# Altium schematic sheet Inputs1.SchDoc
size A4; SheetNumber: 3; SheetTotal: 4
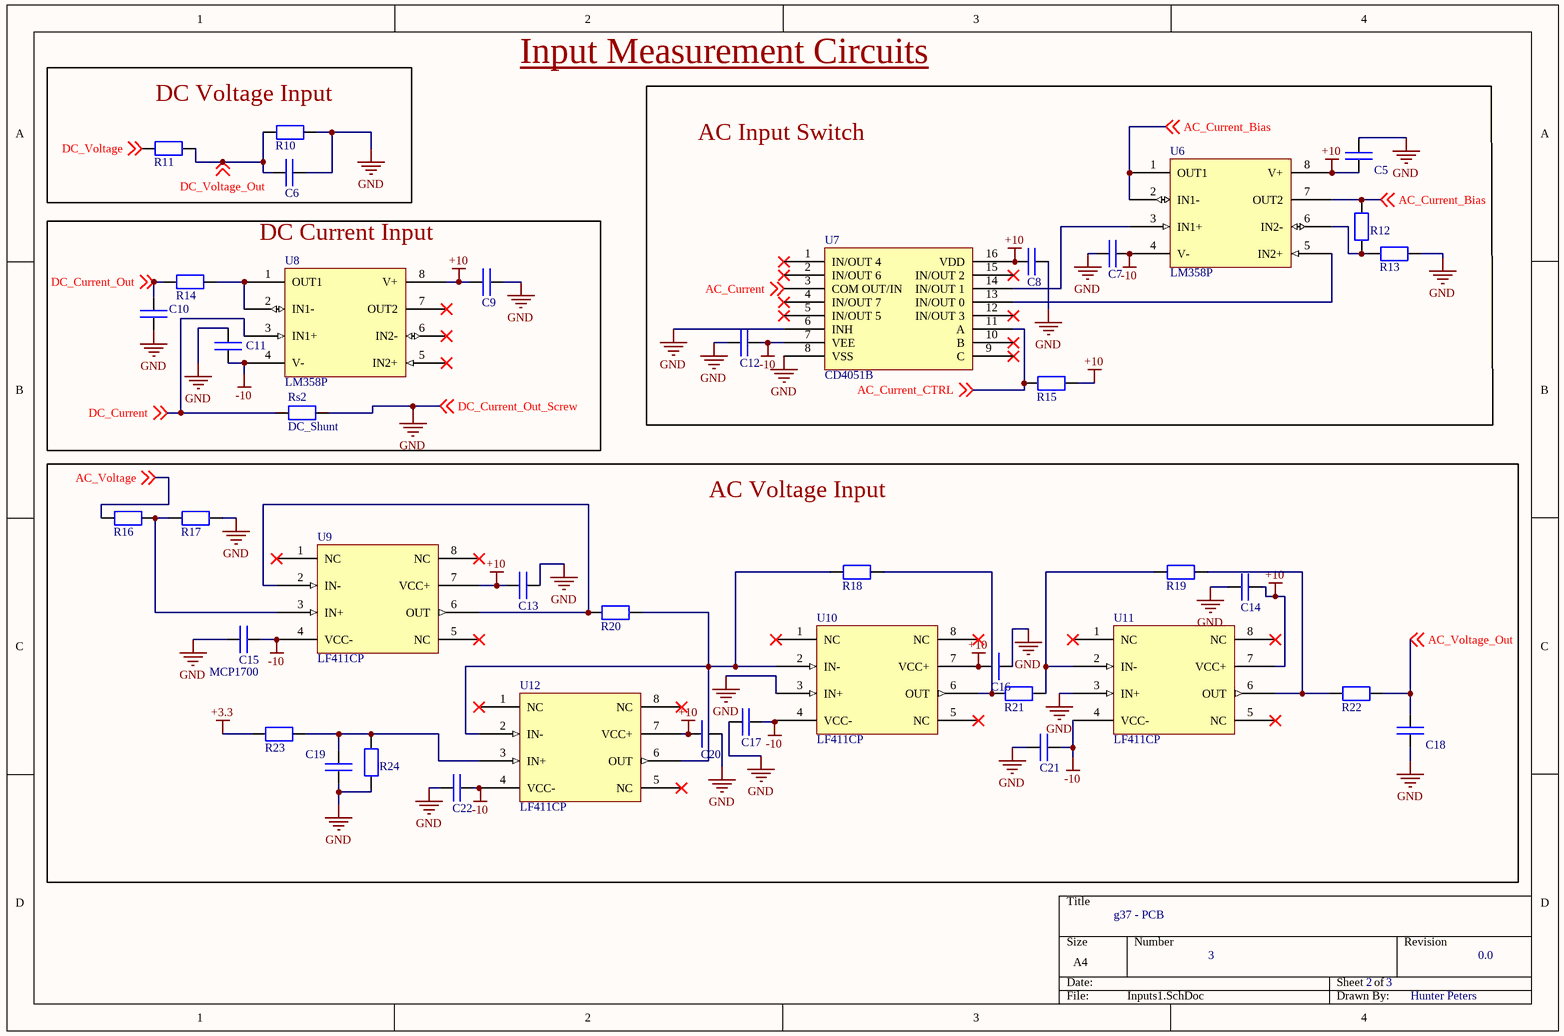
[diagram p0: Inputs1.SchDoc]

## Parts
C5  Capacitor  [Capacitor]  (value not drawn)
C6  Capacitor  [Capacitor]  (value not drawn)
C7  Capacitor  [Capacitor]  (value not drawn)
C8  Capacitor  [Capacitor]  (value not drawn)
C9  Capacitor  [Capacitor]  (value not drawn)
C10  Capacitor  [Capacitor]  (value not drawn)
C11  Capacitor  [Capacitor]  (value not drawn)
C12  Capacitor  [Capacitor]  (value not drawn)
C13  Capacitor  [Capacitor]  (value not drawn)
C14  Capacitor  [Capacitor]  (value not drawn)
C15  Capacitor  [Capacitor]  (value not drawn)
C16  Capacitor  [Capacitor]  (value not drawn)
C17  Capacitor  [Capacitor]  (value not drawn)
C18  Capacitor  [Capacitor]  (value not drawn)
C19  Capacitor  [Capacitor]  (value not drawn)
C20  Capacitor  [Capacitor]  (value not drawn)
C21  Capacitor  [Capacitor]  (value not drawn)
C22  Capacitor  [Capacitor]  (value not drawn)
R10  Resistor  [Resistor]  (value not drawn)
R11  Resistor  [Resistor]  (value not drawn)
R12  Resistor  [Resistor]  (value not drawn)
R13  Resistor  [Resistor]  (value not drawn)
R14  Resistor  [Resistor]  (value not drawn)
R15  4.7kΩ  [Resistor]  (value not drawn)
R16  Resistor  [Resistor]  (value not drawn)
R17  Resistor  [Resistor]  (value not drawn)
R18  Resistor  [Resistor]  (value not drawn)
R19  Resistor  [Resistor]  (value not drawn)
R20  Resistor  [Resistor]  (value not drawn)
R21  Resistor  [Resistor]  (value not drawn)
R22  Resistor  [Resistor]  (value not drawn)
R23  Resistor  [Resistor]  (value not drawn)
R24  Resistor  [Resistor]  (value not drawn)
Rs2  DC_Shunt  [DC_Shunt]
U6  LM358P  [Op Amp]
U7  CD4051B  [Multiplexor]
U8  LM358P  [Op Amp]
U9  LF411CP  [Op Amp]
U10  LF411CP  [Op Amp]
U11  LF411CP  [Op Amp]
U12  LF411CP  [Op Amp]

## Blocks framed on the sheet
DC Voltage Input: C6 R10 R11
AC Input Switch: C5 C7 C8 C12 R12 R13 R15 U6 U7
DC Current Input: C9-C11 R14 Rs2 U8
AC Voltage Input: C13-C22 R16-R24 U9-U12

## Nets
+3.3: R23.1
+10: C5.1 C8.1 C9.1 C13.1 C14.1 C16.1 C20.1 R15.2 U6.8(V+) U7.16(VDD) U8.8(V+) U9.7(VCC+) U10.7(VCC+) U11.7(VCC+) U12.7(VCC+)
-10: C7.2 C11.1 C12.2 C15.2 C17.2 C21.2 C22.2 U6.4(V-) U7.7(VEE) U8.4(V-) U9.4(VCC-) U10.4(VCC-) U11.4(VCC-) U12.4(VCC-)
GND: C5.2 C6.2 C7.1 C8.2 C9.2 C10.1 C11.2 C12.1 C13.2 C14.2 C15.1 C16.2 C17.1 C18.1 C19.1 C20.2 C21.1 C22.1 R10.2 R13.1 R17.2 R24.1 Rs2.2 U7.6(INH) U7.8(VSS) U10.3(IN+) U11.3(IN+) ; off-sheet DC_Current_Out_Screw  [also labelled DC_Current_Out_Screw]
AC_Current: U7.3(COM_OUT/IN) ; off-sheet AC_Current
AC_Current_Bias: R12.2 U6.1(OUT1) U6.2(IN1-) U6.7(OUT2) ; off-sheet AC_Current_Bias
AC_Current_CTRL: R15.1 U7.11(A) ; off-sheet AC_Current_CTRL
AC_Voltage: R16.1 ; off-sheet AC_Voltage
AC_Voltage_Out: C18.2 R22.2 ; off-sheet AC_Voltage_Out
DC_Current: Rs2.1 U8.3(IN1+) ; off-sheet DC_Current
DC_Current_Out: C10.2 R14.1 ; off-sheet DC_Current_Out
DC_Voltage: R11.2 ; off-sheet DC_Voltage
DC_Voltage_Out: C6.1 R10.1 R11.1 ; off-sheet DC_Voltage_Out
NetC19_2: C19.2 R23.2 R24.2 U12.3(IN+)
NetR12_1: R12.1 R13.2 U6.6(IN2-)
NetR14_2: R14.2 U8.1(OUT1) U8.2(IN1-)
NetR16_2: R16.2 R17.1 U9.3(IN+)
NetR18_1: R18.1 R20.2 U10.2(IN-) U12.2(IN-) U12.6(OUT)
NetR18_2: R18.2 R21.1 U10.6(OUT)
NetR19_1: R19.1 R21.2 U11.2(IN-)
NetR19_2: R19.2 R22.1 U11.6(OUT)
NetR20_1: R20.1 U9.2(IN-) U9.6(OUT)
NetU6_3: U6.3(IN1+) U7.14(IN/OUT_1)
NetU6_5: U6.5(IN2+) U7.13(IN/OUT_0)

Not connected (* = marked no-connect by the designer): U7 1(IN/OUT_4)* 2(IN/OUT_6)* 4(IN/OUT_7)* 5(IN/OUT_5)* 9(C)* 10(B)* 12(IN/OUT_3)* 15(IN/OUT_2)*; U8 5(IN2+)* 6(IN2-)* 7(OUT2)*; U9 1(NC)* 5(NC)* 8(NC)*; U10 1(NC)* 5(NC)* 8(NC)*; U11 1(NC)* 5(NC)* 8(NC)*; U12 1(NC)* 5(NC)* 8(NC)*

## Notes on the sheet
- Input Measurement Circuits
- (near C15) MCP1700
- g37 - PCB
- 3
- 2
- 0.0
- Hunter Peters

## Library data of the parts
R15 = Resistor
U6 U8 = LM358P: Operational Amplifier, Dual, 700 Khz, 2, 0.4 V/ S, 1.5V To 16V, Dip, 8 Rohs Compliant: Yes; Manufacturer: Texas Instruments; Manufacturer Lifecycle Status: ACTIVE; Bandwidth: 1MHz; Common Mode Rejection Ratio: 65dB; Dual Supply Voltage: 9V; Gain Bandwidth Product: 700kHz; Input Bias Current: 250nA; Input Offset Voltage (Vos): 7mV; Max Supply Current: 700µA; Max Supply Voltage: 32V; Min Supply Voltage: 3V; Nominal Supply Current: 1.2mA; Number of Amplifiers: 2; Operating Supply Current: 1mA; Output Current: 30mA; Slew Rate: 0.3V/µs; Voltage Gain: 100dB; Supplier 1: DigiKey; Manufacturer Part Number: LM358P; RoHS: Compliant; Category: Amplifiers - Op Amps, Buffer, Instrumentation; Stock 1: 72654; Pricing 1: 1=0.27, 10=0.187, 50=0.153, 100=0.1423, 250=0.13104, 500=0.12426, 1000=0.11868, 2500=0.11278, 5000=0.1102 (USD); Case/Package: PDIP; Contact Plating: Gold; Height: 5.08mm; Lead Free: Lead Free; Length: 9.81mm; Lifecycle Status: Production; Max Dual Supply Voltage: 16V; Max Operating Temperature: 70°C; Min Dual Supply Voltage: 1.5V; Min Operating Temperature: 0°C; Mount: Through Hole; Number of Channels: 2; Number of Circuits: 2; Number of Elements: 2; Number of Pins: 8; Operating Supply Voltage: 16V; Output Current per Channel: 30mA; Power Supply Rejection Ratio (PSRR): 65dB; Radiation Hardening: No; REACH SVHC: No; Schedule B: 8542330000, 8542330000|8542330000|8542330000|8542330000|8542330000|8542330000|8542330000|8542330000|8542330000|8542330000|8542330000|8542330000|8542330000|8542330000|8542330000|8542330000|8542330000|8542330000|8542330000|8542330000|8542330000|8542330000|8542330000|85; Thickness: 3.9mm; Width: 6.35mm; ComponentLink1URL: https://datasheet.octopart.com:443/LM358P-Texas-Instruments-datasheet-22122189.pdf?src-supplier=Texas+Instruments; ComponentLink1Description: https://datasheet.octopart.com:443/LM358P-Texas-Instruments-datasheet-22122189.pdf?src-supplier=Texas+Instruments; ComponentLink2URL: https://octopart.com:443/opatz8j6/c1?t=oqAI8rLcFpUCwQz3XpiQyJu6cvQHEZqsQz-ajVCN9ANwwKTOsKfzA42PIMJelGWuzT3h6SD-c6fpyT0gSSX2jEno0skou8v9j3Jn_12a0HifiHKIe5xyb9D0ZmJu35xXUPkKHYTg9gNLLOZNL_ZRlu9lopCJkqKAh8-EcsD-mij-HCuIcf6e5wcGllE6vrwhH9FYTnOeC7BJcBEDEy-SR6Gf13-dAeqi_gwlv4VpfKxqzu3VdIKpO-63Eg9hZr4wxMFv42TwUYIo25Tt9ZzY3CMy4ptzf0nP6hbmpRkagDXPpxp0_YPC_pQDbKIScxns-zstyRPAOYYCKtuU7TPlFeKjWR049V7cUehsluTRxHTQ5ZZ8Ynx5nPbUd9yzTscO&src-supplier=Texas+Instruments; ComponentLink2Description: https://octopart.com:443/opatz8j6/c1?t=oqAI8rLcFpUCwQz3XpiQyJu6cvQHEZqsQz-ajVCN9ANwwKTOsKfzA42PIMJelGWuzT3h6SD-c6fpyT0gSSX2jEno0skou8v9j3Jn_12a0HifiHKIe5xyb9D0ZmJu35xXUPkKHYTg9gNLLOZNL_ZRlu9lopCJkqKAh8-EcsD-mij-HCuIcf6e5wcGllE6vrwhH9FYTnOeC7BJcBEDEy-SR6Gf13-dAeqi_gwlv4VpfKxqzu3VdIKpO-63Eg9hZr4wxMFv42TwUYIo25Tt9ZzY3CMy4ptzf0nP6hbmpRkagDXPpxp0_YPC_pQDbKIScxns-zstyRPAOYYCKtuU7TPlFeKjWR049V7cUehsluTRxHTQ5ZZ8Ynx5nPbUd9yzTscO&src-supplier=Texas+Instruments; ComponentLink3URL: https://sigma.octopart.com:443/49250158/technical_drawing/Texas-Instruments-LM358P.pdf?src-supplier=Texas+Instruments; ComponentLink3Description: https://sigma.octopart.com:443/49250158/technical_drawing/Texas-Instruments-LM358P.pdf?src-supplier=Texas+Instruments; ComponentLink4URL: https://datasheet.octopart.com:443/LM358P-Texas-Instruments-datasheet-149604.pdf?src-supplier=Upverter; ComponentLink4Description: https://datasheet.octopart.com:443/LM358P-Texas-Instruments-datasheet-149604.pdf?src-supplier=Upverter; ComponentLink5URL: https://datasheet.octopart.com:443/LM358P-Texas-Instruments-datasheet-16079558.pdf?src-supplier=Upverter; ComponentLink5Description: https://datasheet.octopart.com:443/LM358P-Texas-Instruments-datasheet-16079558.pdf?src-supplier=Upverter; ComponentLink6URL: https://datasheet.octopart.com:443/LM358P-Texas-Instruments-datasheet-81454335.pdf?src-supplier=Farnell; ComponentLink6Description: https://datasheet.octopart.com:443/LM358P-Texas-Instruments-datasheet-81454335.pdf?src-supplier=Farnell; ComponentLink7URL: https://datasheet.octopart.com:443/LM358P.-Texas-Instruments-datasheet-65712975.pdf?src-supplier=Farnell; ComponentLink7Description: https://datasheet.octopart.com:443/LM358P.-Texas-Instruments-datasheet-65712975.pdf?src-supplier=Farnell; ComponentLink8URL: https://datasheet.octopart.com:443/LM358P.-Texas-Instruments-datasheet-32750560.pdf?src-supplier=Farnell; ComponentLink8Description: https://datasheet.octopart.com:443/LM358P.-Texas-Instruments-datasheet-32750560.pdf?src-supplier=Farnell; ComponentLink9URL: https://datasheet.octopart.com:443/LM358P-Texas-Instruments-datasheet-10672735.pdf?src-supplier=Farnell; ComponentLink9Description: https://datasheet.octopart.com:443/LM358P-Texas-Instruments-datasheet-10672735.pdf?src-supplier=Farnell; ComponentLink10URL: https://datasheet.octopart.com:443/LM358P..-Texas-Instruments-datasheet-36780029.pdf?src-supplier=element14+APAC; ComponentLink10Description: https://datasheet.octopart.com:443/LM358P..-Texas-Instruments-datasheet-36780029.pdf?src-supplier=element14+APAC; ComponentLink11URL: https://datasheet.octopart.com:443/LM358P-Texas-Instruments-datasheet-2970.pdf?src-supplier=DigiKey; ComponentLink11Description: https://datasheet.octopart.com:443/LM358P-Texas-Instruments-datasheet-2970.pdf?src-supplier=DigiKey; ComponentLink12URL: https://datasheet.octopart.com:443/LM358P-Texas-Instruments-datasheet-159115118.pdf?src-supplier=LCSC; ComponentLink12Description: https://datasheet.octopart.com:443/LM358P-Texas-Instruments-datasheet-159115118.pdf?src-supplier=LCSC; ComponentLink13URL: https://datasheet.octopart.com:443/LM358P-Texas-Instruments-datasheet-147835639.pdf?src-supplier=SHENGYU+ELECTRONICS; ComponentLink13Description: https://datasheet.octopart.com:443/LM358P-Texas-Instruments-datasheet-147835639.pdf?src-supplier=SHENGYU+ELECTRONICS; ComponentLink14URL: https://datasheet.octopart.com:443/LM358P-Texas-Instruments-datasheet-101363746.pdf?src-supplier=Megastar; ComponentLink14Description: https://datasheet.octopart.com:443/LM358P-Texas-Instruments-datasheet-101363746.pdf?src-supplier=Megastar; ComponentLink15URL: https://datasheet.octopart.com:443/LM358P-Texas-Instruments-datasheet-137316104.pdf?src-supplier=Future+Electronics; ComponentLink15Description: https://datasheet.octopart.com:443/LM358P-Texas-Instruments-datasheet-137316104.pdf?src-supplier=Future+Electronics; ComponentLink16URL: https://datasheet.octopart.com:443/LM358P-Texas-Instruments-datasheet-21220556.pdf?src-supplier=Newark; ComponentLink16Description: https://datasheet.octopart.com:443/LM358P-Texas-Instruments-datasheet-21220556.pdf?src-supplier=Newark; ComponentLink17URL: https://datasheet.octopart.com:443/LM358P-Texas-Instruments-datasheet-14137277.pdf?src-supplier=iiiC; ComponentLink17Description: https://datasheet.octopart.com:443/LM358P-Texas-Instruments-datasheet-14137277.pdf?src-supplier=iiiC; ComponentLink18URL: https://datasheet.octopart.com:443/LM358P-Texas-Instruments-datasheet-10086281.pdf?src-supplier=element14; ComponentLink18Description: https://datasheet.octopart.com:443/LM358P-Texas-Instruments-datasheet-10086281.pdf?src-supplier=element14; ComponentLink19URL: https://datasheet.octopart.com:443/LM358P-Texas-Instruments-datasheet-8861238.pdf?src-supplier=element14; ComponentLink19Description: https://datasheet.octopart.com:443/LM358P-Texas-Instruments-datasheet-8861238.pdf?src-supplier=element14; ComponentLink20URL: https://datasheet.octopart.com:443/LM358P-Texas-Instruments-datasheet-8728431.pdf?src-supplier=element14; ComponentLink20Description: https://datasheet.octopart.com:443/LM358P-Texas-Instruments-datasheet-8728431.pdf?src-supplier=element14; ComponentLink21URL: https://datasheet.octopart.com:443/LM358P-Texas-Instruments-datasheet-8637033.pdf?src-supplier=element14; ComponentLink21Description: https://datasheet.octopart.com:443/LM358P-Texas-Instruments-datasheet-8637033.pdf?src-supplier=element14; ComponentLink22URL: https://datasheet.octopart.com:443/LM358P-Texas-Instruments-datasheet-17597669.pdf?src-supplier=TME; ComponentLink22Description: https://datasheet.octopart.com:443/LM358P-Texas-Instruments-datasheet-17597669.pdf?src-supplier=TME; ComponentLink23URL: https://datasheet.octopart.com:443/LM358P-Texas-Instruments-datasheet-8220297.pdf?src-supplier=Jameco; ComponentLink23Description: https://datasheet.octopart.com:443/LM358P-Texas-Instruments-datasheet-8220297.pdf?src-supplier=Jameco; ComponentLink24URL: https://datasheet.octopart.com:443/LM358P-Texas-Instruments-datasheet-111658.pdf?src-supplier=Sierra+IC; ComponentLink24Description: https://datasheet.octopart.com:443/LM358P-Texas-Instruments-datasheet-111658.pdf?src-supplier=Sierra+IC; ComponentLink25URL: http://sigma.octopart.com:80/reach_statement/Texas-Instruments-company-64.pdf?src-supplier=Compliance+Statements; ComponentLink25Description: http://sigma.octopart.com:80/reach_statement/Texas-Instruments-company-64.pdf?src-supplier=Compliance+Statements; ComponentLink26URL: http://sigma.octopart.com:80/conflict_mineral_statement/Texas-Instruments-company-63.pdf?src-supplier=Compliance+Statements; ComponentLink26Description: http://sigma.octopart.com:80/conflict_mineral_statement/Texas-Instruments-company-63.pdf?src-supplier=Compliance+Statements; Supplier Part Number 1: 296-1395-5-ND
U7 = CD4051BE: CD4051B Series 20 V 100 nA CMOS Single 8-Channel Analog Multiplexer - PDIP-16; Manufacturer: Texas Instruments; Manufacturer Lifecycle Status: ACTIVE; Bandwidth: 20MHz; Drain to Source Resistance: 240Ω; Dual Supply Voltage: 3V; Logic Function: Demultiplexer, Multiplexer, Mux; Max Dual Supply Voltage: 9V; Max Supply Voltage: 20V; Min Dual Supply Voltage: 2.5V; Nominal Supply Current: 80nA; Number of Bits: 8; Number of Circuits: 1; Operating Supply Voltage: 18V; Polarity: Non-Inverting; Propagation Delay: 60ns; Supply Type: Dual, Single; Turn-Off Delay Time: 450ns; Turn-On Delay Time: 720ns; Supplier 1: DigiKey; Manufacturer Part Number: CD4051BE; RoHS: Compliant; Category: Analog Switches and Multiplexers; Stock 1: 4495; Pricing 1: 1=0.8, 10=0.568, 25=0.5108, 100=0.4479, 250=0.41796, 500=0.3999, 1000=0.38504, 2500=0.36936, 5000=0.35991 (USD); Case/Package: PDIP; Contact Plating: Tin; Height: 5.08mm; Lead Free: Lead Free; Length: 19.3mm; Lifecycle Status: Production; Max Operating Temperature: 125°C; Min Operating Temperature: -55°C; Min Supply Voltage: 3V; Min Supply Voltage (DC): 3V; Mount: Through Hole; Number of Channels: 8; Number of Gates: 1; Number of Inputs: 8; Number of Pins: 16; Operating Supply Current: 80nA; Quiescent Current: 80nA; Radiation Hardening: No; REACH SVHC: No; Resistance: 240Ω; Schedule B: 8542390000, 8542390000|8542390000|8542390000|8542390000|8542390000|8542390000|8542390000|8542390000|8542390000|8542390000|8542390000|8542390000|8542390000|8542390000|8542390000|8542390000|8542390000|8542390000|8542390000|8542390000|8542390000|8542390000|8542390000|85; Thickness: 3.9mm; Weight: 951.693491mg; Width: 6.35mm; ComponentLink1URL: https://datasheet.octopart.com:443/CD4051BE-Texas-Instruments-datasheet-41214435.pdf?src-supplier=Texas+Instruments; ComponentLink1Description: https://datasheet.octopart.com:443/CD4051BE-Texas-Instruments-datasheet-41214435.pdf?src-supplier=Texas+Instruments; ComponentLink2URL: https://octopart.com:443/opatz8j6/c1?t=UIfRW14eXhIfOF-oFZ6Q5J66j7PnUsDjt-DLRZv_ne4_WiumMkbXx4rniWKDRQWco0c1A10nEU92iBnjKMIo5KjEBL51Ak-2lkuqMbbpcID5g9fRMoz5DgekRImzSQik1OPk2t9RJpeedauIwahmVtI3gTHC42d6XSj0Uau-qhabpl_wXRd-29TaXMBJ7wO7fIz0V_HzD_C70tPsu40Tn1cil4nKPp6cB3GfDvcANLGUEQXsGt6YWVv3-ioL5EzUk8hYm1ZisYe4m3mFIzjPX1C895qkWPqY_VotFC2s6MaYWvoNxagzj2oPdc8hXeyaNzAy6VkZktOcbdmdhbAVYym2grw-0VwWrIK_rtRIbd5hGGQdgoqSEIJ3mXl6Yi3iSw&src-supplier=Texas+Instruments; ComponentLink2Description: https://octopart.com:443/opatz8j6/c1?t=UIfRW14eXhIfOF-oFZ6Q5J66j7PnUsDjt-DLRZv_ne4_WiumMkbXx4rniWKDRQWco0c1A10nEU92iBnjKMIo5KjEBL51Ak-2lkuqMbbpcID5g9fRMoz5DgekRImzSQik1OPk2t9RJpeedauIwahmVtI3gTHC42d6XSj0Uau-qhabpl_wXRd-29TaXMBJ7wO7fIz0V_HzD_C70tPsu40Tn1cil4nKPp6cB3GfDvcANLGUEQXsGt6YWVv3-ioL5EzUk8hYm1ZisYe4m3mFIzjPX1C895qkWPqY_VotFC2s6MaYWvoNxagzj2oPdc8hXeyaNzAy6VkZktOcbdmdhbAVYym2grw-0VwWrIK_rtRIbd5hGGQdgoqSEIJ3mXl6Yi3iSw&src-supplier=Texas+Instruments; ComponentLink3URL: https://datasheet.octopart.com:443/CD4051BE-Texas-Instruments-datasheet-148785.pdf?src-supplier=Texas+Instruments; ComponentLink3Description: https://datasheet.octopart.com:443/CD4051BE-Texas-Instruments-datasheet-148785.pdf?src-supplier=Texas+Instruments; ComponentLink4URL: https://sigma.octopart.com:443/49249812/technical_drawing/Texas-Instruments-CD4051BE.pdf?src-supplier=Texas+Instruments; ComponentLink4Description: https://sigma.octopart.com:443/49249812/technical_drawing/Texas-Instruments-CD4051BE.pdf?src-supplier=Texas+Instruments; ComponentLink5URL: https://datasheet.octopart.com:443/CD4051BE-Texas-Instruments-datasheet-10253597.pdf?src-supplier=Farnell; ComponentLink5Description: https://datasheet.octopart.com:443/CD4051BE-Texas-Instruments-datasheet-10253597.pdf?src-supplier=Farnell; ComponentLink6URL: https://datasheet.octopart.com:443/CD4051BE-Texas-Instruments-datasheet-62345999.pdf?src-supplier=Farnell; ComponentLink6Description: https://datasheet.octopart.com:443/CD4051BE-Texas-Instruments-datasheet-62345999.pdf?src-supplier=Farnell; ComponentLink7URL: https://datasheet.octopart.com:443/CD4051BE-Texas-Instruments-datasheet-8384997.pdf?src-supplier=Farnell; ComponentLink7Description: https://datasheet.octopart.com:443/CD4051BE-Texas-Instruments-datasheet-8384997.pdf?src-supplier=Farnell; ComponentLink8URL: https://datasheet.octopart.com:443/CD4051BE-Texas-Instruments-datasheet-10694235.pdf?src-supplier=Farnell; ComponentLink8Description: https://datasheet.octopart.com:443/CD4051BE-Texas-Instruments-datasheet-10694235.pdf?src-supplier=Farnell; ComponentLink9URL: https://datasheet.octopart.com:443/CD4051BE-Texas-Instruments-datasheet-10411452.pdf?src-supplier=Farnell; ComponentLink9Description: https://datasheet.octopart.com:443/CD4051BE-Texas-Instruments-datasheet-10411452.pdf?src-supplier=Farnell; ComponentLink10URL: https://datasheet.octopart.com:443/CD4051BE-Texas-Instruments-datasheet-10189767.pdf?src-supplier=Farnell; ComponentLink10Description: https://datasheet.octopart.com:443/CD4051BE-Texas-Instruments-datasheet-10189767.pdf?src-supplier=Farnell; ComponentLink11URL: https://datasheet.octopart.com:443/CD4051BE-Texas-Instruments-datasheet-8763554.pdf?src-supplier=Farnell; ComponentLink11Description: https://datasheet.octopart.com:443/CD4051BE-Texas-Instruments-datasheet-8763554.pdf?src-supplier=Farnell; ComponentLink12URL: https://datasheet.octopart.com:443/CD4051BE-Texas-Instruments-datasheet-5330332.pdf?src-supplier=Farnell; ComponentLink12Description: https://datasheet.octopart.com:443/CD4051BE-Texas-Instruments-datasheet-5330332.pdf?src-supplier=Farnell; ComponentLink13URL: https://datasheet.octopart.com:443/CD4051BE-Texas-Instruments-datasheet-5364360.pdf?src-supplier=Farnell; ComponentLink13Description: https://datasheet.octopart.com:443/CD4051BE-Texas-Instruments-datasheet-5364360.pdf?src-supplier=Farnell; ComponentLink14URL: https://datasheet.octopart.com:443/CD4051BE-Texas-Instruments-datasheet-17021337.pdf?src-supplier=Future+Electronics; ComponentLink14Description: https://datasheet.octopart.com:443/CD4051BE-Texas-Instruments-datasheet-17021337.pdf?src-supplier=Future+Electronics; ComponentLink15URL: https://datasheet.octopart.com:443/CD4051BE-Texas-Instruments-datasheet-42768.pdf?src-supplier=Mouser; ComponentLink15Description: https://datasheet.octopart.com:443/CD4051BE-Texas-Instruments-datasheet-42768.pdf?src-supplier=Mouser; ComponentLink16URL: https://datasheet.octopart.com:443/CD4051BE-Texas-Instruments-datasheet-159114769.pdf?src-supplier=Burklin+Elektronik; ComponentLink16Description: https://datasheet.octopart.com:443/CD4051BE-Texas-Instruments-datasheet-159114769.pdf?src-supplier=Burklin+Elektronik; ComponentLink17URL: https://datasheet.octopart.com:443/CD4051BE-Texas-Instruments-datasheet-47642707.pdf?src-supplier=TME; ComponentLink17Description: https://datasheet.octopart.com:443/CD4051BE-Texas-Instruments-datasheet-47642707.pdf?src-supplier=TME; ComponentLink18URL: https://datasheet.octopart.com:443/CD4051BE-Texas-Instruments-datasheet-163810140.pdf?src-supplier=SHENGYU+ELECTRONICS; ComponentLink18Description: https://datasheet.octopart.com:443/CD4051BE-Texas-Instruments-datasheet-163810140.pdf?src-supplier=SHENGYU+ELECTRONICS; ComponentLink19URL: https://datasheet.octopart.com:443/CD4051BE-Texas-Instruments-datasheet-163656050.pdf?src-supplier=LCSC; ComponentLink19Description: https://datasheet.octopart.com:443/CD4051BE-Texas-Instruments-datasheet-163656050.pdf?src-supplier=LCSC; ComponentLink20URL: https://datasheet.octopart.com:443/CD4051BE-Texas-Instruments-datasheet-37129006.pdf?src-supplier=Newark; ComponentLink20Description: https://datasheet.octopart.com:443/CD4051BE-Texas-Instruments-datasheet-37129006.pdf?src-supplier=Newark; ComponentLink21URL: https://datasheet.octopart.com:443/CD4051BE-Texas-Instruments-datasheet-21220570.pdf?src-supplier=Newark; ComponentLink21Description: https://datasheet.octopart.com:443/CD4051BE-Texas-Instruments-datasheet-21220570.pdf?src-supplier=Newark; ComponentLink22URL: https://datasheet.octopart.com:443/CD4051BE-Texas-Instruments-datasheet-32026515.pdf?src-supplier=element14+APAC; ComponentLink22Description: https://datasheet.octopart.com:443/CD4051BE-Texas-Instruments-datasheet-32026515.pdf?src-supplier=element14+APAC; ComponentLink23URL: https://datasheet.octopart.com:443/CD4051BE-Texas-Instruments-datasheet-14119637.pdf?src-supplier=iiiC; ComponentLink23Description: https://datasheet.octopart.com:443/CD4051BE-Texas-Instruments-datasheet-14119637.pdf?src-supplier=iiiC; ComponentLink24URL: https://datasheet.octopart.com:443/CD4051BE-Texas-Instruments-datasheet-10104488.pdf?src-supplier=element14; ComponentLink24Description: https://datasheet.octopart.com:443/CD4051BE-Texas-Instruments-datasheet-10104488.pdf?src-supplier=element14; ComponentLink25URL: https://datasheet.octopart.com:443/CD4051BE-Texas-Instruments-datasheet-10059866.pdf?src-supplier=element14; ComponentLink25Description: https://datasheet.octopart.com:443/CD4051BE-Texas-Instruments-datasheet-10059866.pdf?src-supplier=element14; ComponentLink26URL: https://datasheet.octopart.com:443/CD4051BE-Texas-Instruments-datasheet-7280354.pdf?src-supplier=Jameco; ComponentLink26Description: https://datasheet.octopart.com:443/CD4051BE-Texas-Instruments-datasheet-7280354.pdf?src-supplier=Jameco; ComponentLink27URL: https://datasheet.octopart.com:443/CD4051BE-Texas-Instruments-datasheet-38186.pdf?src-supplier=RS+(Formerly+Allied+Electronics); ComponentLink27Description: https://datasheet.octopart.com:443/CD4051BE-Texas-Instruments-datasheet-38186.pdf?src-supplier=RS+(Formerly+Allied+Electronics); ComponentLink28URL: https://datasheet.octopart.com:443/CD4051BE-Texas-Instruments-datasheet-115798.pdf?src-supplier=Sierra+IC; ComponentLink28Description: https://datasheet.octopart.com:443/CD4051BE-Texas-Instruments-datasheet-115798.pdf?src-supplier=Sierra+IC; ComponentLink29URL: http://sigma.octopart.com:80/reach_statement/Texas-Instruments-company-64.pdf?src-supplier=Compliance+Statements; ComponentLink29Description: http://sigma.octopart.com:80/reach_statement/Texas-Instruments-company-64.pdf?src-supplier=Compliance+Statements; ComponentLink30URL: http://sigma.octopart.com:80/conflict_mineral_statement/Texas-Instruments-company-63.pdf?src-supplier=Compliance+Statements; ComponentLink30Description: http://sigma.octopart.com:80/conflict_mineral_statement/Texas-Instruments-company-63.pdf?src-supplier=Compliance+Statements; Supplier Part Number 1: 296-2057-5-ND
U9-U12 = LF411CP: Operational Amplifier, 1 Func, 2000uV Offset-Max, JFET, PDIP8; Manufacturer: Texas Instruments; Manufacturer Lifecycle Status: ACTIVE; Bandwidth: 3MHz; Common Mode Rejection Ratio: 70dB; Dual Supply Voltage: 9V; Input Bias Current: 50pA; Input Offset Voltage (Vos): 800µV; Max Dual Supply Voltage: 18V; Min Dual Supply Voltage: 3.5V; Nominal Supply Current: 2mA; Number of Amplifiers: 1; Slew Rate: 13V/µs; Voltage Gain: 106.02dB; Supplier 1: DigiKey; Manufacturer Part Number: LF411CP; RoHS: Compliant; Category: Amplifiers - Op Amps, Buffer, Instrumentation; Stock 1: 1651; Pricing 1: 1=1.89, 10=1.392, 50=1.1922, 100=1.1302, 250=1.06472, 500=1.02526, 1000=0.99277, 2500=0.95848, 5000=0.93781 (USD); Ambient Temperature Range High: 70°C; Case/Package: PDIP; Gain Bandwidth Product: 3MHz; Height: 5.08mm; Lead Free: Lead Free; Length: 9.81mm; Lifecycle Status: Production; Max Operating Temperature: 70°C; Max Supply Voltage: 18V; Min Operating Temperature: 0°C; Min Supply Voltage: 3.5V; Mount: Through Hole; Number of Channels: 1; Number of Circuits: 1; Number of Elements: 1; Number of Pins: 8; Operating Supply Current: 2mA; Operating Supply Voltage: 18V; Packaging: Rail/Tube; Radiation Hardening: No; REACH SVHC: No; Schedule B: 8542330000, 8542330000|8542330000|8542330000|8542330000|8542330000; Thickness: 3.9mm; Width: 6.35mm; ComponentLink1URL: https://octopart.com:443/opatz8j6/c1?t=ME9Kw5m9dXWfcXky85tAcHSyYlC8apoAZ8-3gre8b_nSina7puu2hP8TwWnfTs3EPeSjX34nqyTitdSFLs_8QGBgHX6ww4XlTFDgyVNlqbWD734mBrk3_tKI5cnxKlAKfKpGQ4qpv40VtQydaFuTpCPyxMtPIXymfvkq-wgZ2iYYC59fUWRRvOqwP5ghjkfPHXa6W8o3ZhqP265dUXWWeYnFDnAQeTWHD9G2zSMM2k3qVNsbcUXv1JY2EX9HSKcvO5VCVgy-f0kGF7zpLYVPUm_lO1vQG-OiufpRT80XQYLiZAB9fTbyyp6S8sS6LBfEamcry8ZtT7mRzWiBFXFYfVMsnVtz1ltjCeQae7iXIE2CNjtUpcme9pxYmzJIEchvww&src-supplier=Texas+Instruments; ComponentLink1Description: https://octopart.com:443/opatz8j6/c1?t=ME9Kw5m9dXWfcXky85tAcHSyYlC8apoAZ8-3gre8b_nSina7puu2hP8TwWnfTs3EPeSjX34nqyTitdSFLs_8QGBgHX6ww4XlTFDgyVNlqbWD734mBrk3_tKI5cnxKlAKfKpGQ4qpv40VtQydaFuTpCPyxMtPIXymfvkq-wgZ2iYYC59fUWRRvOqwP5ghjkfPHXa6W8o3ZhqP265dUXWWeYnFDnAQeTWHD9G2zSMM2k3qVNsbcUXv1JY2EX9HSKcvO5VCVgy-f0kGF7zpLYVPUm_lO1vQG-OiufpRT80XQYLiZAB9fTbyyp6S8sS6LBfEamcry8ZtT7mRzWiBFXFYfVMsnVtz1ltjCeQae7iXIE2CNjtUpcme9pxYmzJIEchvww&src-supplier=Texas+Instruments; ComponentLink2URL: https://datasheet.octopart.com:443/LF411CP-Texas-Instruments-datasheet-10255057.pdf?src-supplier=Texas+Instruments; ComponentLink2Description: https://datasheet.octopart.com:443/LF411CP-Texas-Instruments-datasheet-10255057.pdf?src-supplier=Texas+Instruments; ComponentLink3URL: https://sigma.octopart.com:443/49250158/technical_drawing/Texas-Instruments-LF411CP.pdf?src-supplier=Texas+Instruments; ComponentLink3Description: https://sigma.octopart.com:443/49250158/technical_drawing/Texas-Instruments-LF411CP.pdf?src-supplier=Texas+Instruments; ComponentLink4URL: https://datasheet.octopart.com:443/LF411CP-Texas-Instruments-datasheet-152016.pdf?src-supplier=Texas+Instruments; ComponentLink4Description: https://datasheet.octopart.com:443/LF411CP-Texas-Instruments-datasheet-152016.pdf?src-supplier=Texas+Instruments; ComponentLink5URL: https://datasheet.octopart.com:443/LF411CP-Texas-Instruments-datasheet-149597787.pdf?src-supplier=Upverter; ComponentLink5Description: https://datasheet.octopart.com:443/LF411CP-Texas-Instruments-datasheet-149597787.pdf?src-supplier=Upverter; ComponentLink6URL: https://datasheet.octopart.com:443/LF411CP-Texas-Instruments-datasheet-33010185.pdf?src-supplier=Newark; ComponentLink6Description: https://datasheet.octopart.com:443/LF411CP-Texas-Instruments-datasheet-33010185.pdf?src-supplier=Newark; ComponentLink7URL: https://datasheet.octopart.com:443/LF411CP-Texas-Instruments-datasheet-29029183.pdf?src-supplier=Newark; ComponentLink7Description: https://datasheet.octopart.com:443/LF411CP-Texas-Instruments-datasheet-29029183.pdf?src-supplier=Newark; ComponentLink8URL: https://datasheet.octopart.com:443/LF411CP-Texas-Instruments-datasheet-17727392.pdf?src-supplier=Newark; ComponentLink8Description: https://datasheet.octopart.com:443/LF411CP-Texas-Instruments-datasheet-17727392.pdf?src-supplier=Newark; ComponentLink9URL: https://datasheet.octopart.com:443/LF411CP-Texas-Instruments-datasheet-20723.pdf?src-supplier=Newark; ComponentLink9Description: https://datasheet.octopart.com:443/LF411CP-Texas-Instruments-datasheet-20723.pdf?src-supplier=Newark; ComponentLink10URL: https://datasheet.octopart.com:443/LF411CP-Texas-Instruments-datasheet-8787176.pdf?src-supplier=Verical; ComponentLink10Description: https://datasheet.octopart.com:443/LF411CP-Texas-Instruments-datasheet-8787176.pdf?src-supplier=Verical; ComponentLink11URL: https://datasheet.octopart.com:443/LF411CP-Texas-Instruments-datasheet-8639286.pdf?src-supplier=element14; ComponentLink11Description: https://datasheet.octopart.com:443/LF411CP-Texas-Instruments-datasheet-8639286.pdf?src-supplier=element14; ComponentLink12URL: https://datasheet.octopart.com:443/LF411CP-Texas-Instruments-datasheet-5316506.pdf?src-supplier=element14; ComponentLink12Description: https://datasheet.octopart.com:443/LF411CP-Texas-Instruments-datasheet-5316506.pdf?src-supplier=element14; ComponentLink13URL: https://datasheet.octopart.com:443/LF411CP-Texas-Instruments-datasheet-166161800.pdf?src-supplier=LCSC; ComponentLink13Description: https://datasheet.octopart.com:443/LF411CP-Texas-Instruments-datasheet-166161800.pdf?src-supplier=LCSC; ComponentLink14URL: https://datasheet.octopart.com:443/LF411CP-Texas-Instruments-datasheet-14138788.pdf?src-supplier=iiiC; ComponentLink14Description: https://datasheet.octopart.com:443/LF411CP-Texas-Instruments-datasheet-14138788.pdf?src-supplier=iiiC; ComponentLink15URL: https://datasheet.octopart.com:443/LF411CP-Texas-Instruments-datasheet-124340.pdf?src-supplier=DigiKey; ComponentLink15Description: https://datasheet.octopart.com:443/LF411CP-Texas-Instruments-datasheet-124340.pdf?src-supplier=DigiKey; ComponentLink16URL: https://datasheet.octopart.com:443/LF411CP-Texas-Instruments-datasheet-114211.pdf?src-supplier=Sierra+IC; ComponentLink16Description: https://datasheet.octopart.com:443/LF411CP-Texas-Instruments-datasheet-114211.pdf?src-supplier=Sierra+IC; ComponentLink17URL: http://sigma.octopart.com:80/reach_statement/Texas-Instruments-company-64.pdf?src-supplier=Compliance+Statements; ComponentLink17Description: http://sigma.octopart.com:80/reach_statement/Texas-Instruments-company-64.pdf?src-supplier=Compliance+Statements; ComponentLink18URL: http://sigma.octopart.com:80/conflict_mineral_statement/Texas-Instruments-company-63.pdf?src-supplier=Compliance+Statements; ComponentLink18Description: http://sigma.octopart.com:80/conflict_mineral_statement/Texas-Instruments-company-63.pdf?src-supplier=Compliance+Statements; Supplier Part Number 1: 296-26079-5-ND